# Altium schematic sheet Laser_Tec_Control.SchDoc
size A4; SheetNumber: 3; SheetTotal: 4
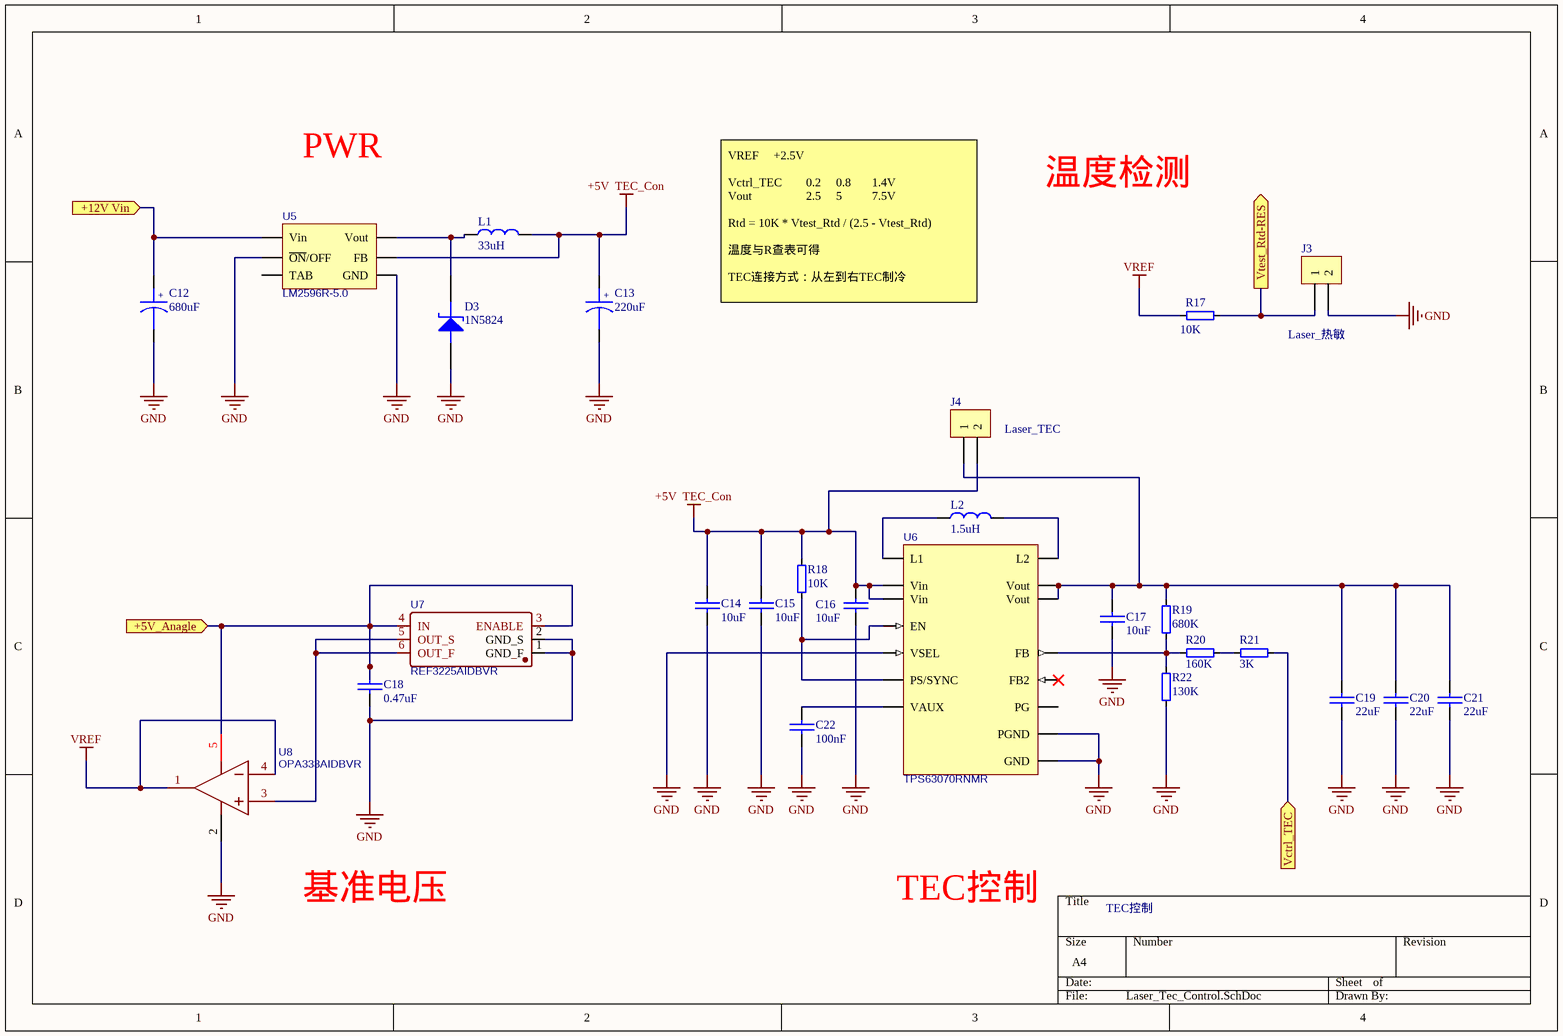
[diagram p0: Laser_Tec_Control.SchDoc]

## Parts
C12  680uF  [CAP-TH_BD8.0-P3.50-D0.6-FD]
C13  220uF  [CAP-TH_BD8.0-P3.50-D0.6-FD]
C14  10uF  [C 0603_M]
C15  10uF  [C 0603_M]
C16  10uF  [C 0603_M]
C17  10uF  [C 0603_M]
C18  0.47uF  [C 0603_M]
C19  22uF  [C 0603_M]
C20  22uF  [C 0603_M]
C21  22uF  [C 0603_M]
C22  100nF  [C 0603_M]
D3  1N5824  [SMA_L4.3-W2.6-LS5.0-RD]
J3  Laser_热敏  [KF128-5.08-2P]
J4  Laser_TEC  [KF128-5.08-2P]
L1  33uH  [L 0805]
L2  1.5uH  [L 0805]
R17  10K  [0603R]
R18  10K  [0603R]
R19  680K  [0603R]
R20  160K  [0603R]
R21  3K  [0603R]
R22  130K  [0603R]
U5  LM2596R-5.0  [TO-263-5_L10.2-W8.6-P1.70-LS14.4-TL]
U6  TPS63070RNMR  [VQFN-HR-15_L3.0-W2.5-P0.50-BL_TPS63070RNMR]
U7  REF3225AIDBVR  [SOT-23-6_L2.9-W1.6-P0.95-LS2.8-BL]
U8  OPA333AIDBVR  [SOT-23-5_L3.0-W1.7-P0.95-LS2.8-BR]

## Ports
+5V_Anagle (in), +12V Vin (in), Vctrl_TEC (in), Vtest_Rtd-RES (out)

## Nets
+5V  TEC_Con: C13.1 C14.1 C15.1 C16.1 J4.2 L1.1 R18.2 U5.4(FB) U6.12(Vin) U6.13(Vin)
GND: C12.2 C13.2 C14.2 C15.2 C16.2 C17.2 C18.2 C19.2 C20.2 C21.2 C22.2 D3.1(A) J3.2 R22.1 U5.3(GND) U5.5(~{ON}/OFF) U6.4(GND) U6.10(PGND) U6.15(VSEL) U7.1(GND_F) U7.2(GND_S) U8.2(V-)
VREF: R17.1 U8.1(OUT) U8.4(IN-)
+5V_Anagle: C18.1 U7.3(ENABLE) U7.4(IN) U8.5(V+) ; port +5V_Anagle
+12V Vin: C12.1 U5.1(Vin) ; port +12V Vin
Vctrl_TEC: R21.1 ; port Vctrl_TEC
Vtest_Rtd-RES: J3.1 R17.2 ; port Vtest_Rtd-RES
NetC17_1: C17.1 C19.1 C20.1 C21.1 J4.1 R19.2 U6.7(Vout) U6.8(Vout)
NetC22_1: C22.1 U6.3(VAUX)
NetD3_2: D3.2(K) L1.2 U5.2(Vout)
NetL2_1: L2.1 U6.9(L2)
NetL2_2: L2.2 U6.11(L1)
NetR18_1: R18.1 U6.1(PS/SYNC) U6.14(EN)
NetR19_1: R19.1 R20.2 R22.2 U6.5(FB)
NetR20_1: R20.1 R21.2
NetU7_5: U7.5(OUT_S) U7.6(OUT_F) U8.3(IN+)

Not connected (* = marked no-connect by the designer): U5 6(TAB); U6 2(PG) 6(FB2)*

## Notes on the sheet
- PWR
- 温度检测
- VREF     +2.5V
  Vctrl_TEC        0.2     0.8       1.4V
  Vout                  2.5     5          7.5V
  Rtd = 10K * Vtest_Rtd / (2.5 - Vtest_Rtd)
  温度与R查表可得
  TEC连接方式：从左到右TEC制冷
- 基准电压
- TEC控制
- (in symbol 电解电容1) +

## Library data of the parts
C12 C13 = 电解电容1: Capacitor
C14 C20 C21 = 普通电容: Capacitor 0805
C15 C19 = 普通电容: Capacitor,0805
C16 C17 = 普通电容: Capacitor,0603
C18 C22 = 普通电容: Capacitor
D3 = 1N5824: Zener Diode
J3 J4 = SIP2: jointbar
L1 L2 = L1: 电感
R17-R22 = 普通电阻
U5 = LM2596R-5.0: BOM_Manufacturer: HTC; BOM_Supplier: LCSC; BOM_Manufacturer Part: LM2596R-5.0; BOM_Supplier Part: C77782; BOM_JLCPCB Part Class: Extended Part; spicePre: U; spiceSymbolName: LM2596R-5.0
U6 = TPS63070RNMR: BOM_Manufacturer: TI; BOM_Supplier: LCSC; BOM_Manufacturer Part: TPS63070RNMR; BOM_Supplier Part: C109322; BOM_JLCPCB Part Class: Extended Part; spicePre: U; spiceSymbolName: TPS63070RNMR
U7 = REF3225AIDBVR: BOM_Manufacturer: TI; BOM_Supplier: LCSC; BOM_Manufacturer Part: REF3225AIDBVR; BOM_Supplier Part: C40852; BOM_JLCPCB Part Class: Extended Part; spicePre: U; spiceSymbolName: REF3225AIDBVR
U8 = OPA333AIDBVR: BOM_Manufacturer: TI; Contributor: LCSC; BOM_Supplier: LCSC; BOM_Manufacturer Part: OPA333AIDBVR; BOM_Supplier Part: C30878; BOM_JLCPCB Part Class: Extended Part; spicePre: U; spiceSymbolName: OPA333AIDBVR